# Altium schematic sheet Power.SchDoc
size A; SheetNumber: 5; SheetTotal: 5
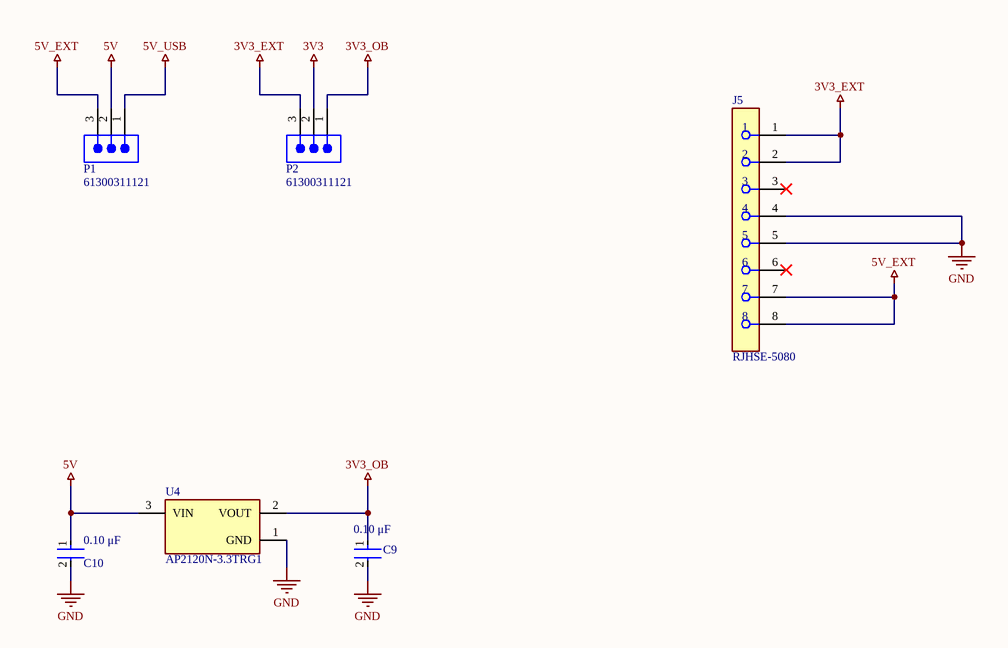
[diagram p0: Power.SchDoc]

## Parts
C9  Capacitance: 0.10 μF  [FP-C0603C-CF-MFG]  (hidden comment: C0603C104K5RACTU)
C10  Capacitance: 0.10 μF  [FP-C0603C-CF-MFG]  (hidden comment: C0603C104K5RACTU)
J5  RJHSE-5080  [FP-RJHSE-5080-MFG]
P1  61300311121  [61300311121]
P2  61300311121  [61300311121]
U4  AP2120N-3.3TRG1  [FP-SOT23-MFG]

## Nets
3V3: P2.2
3V3_EXT: J5.1 J5.2 P2.3
3V3_OB: C9.1 P2.1 U4.2(VOUT)
5V: C10.1 P1.2 U4.3(VIN)
5V_EXT: J5.7 J5.8 P1.3
5V_USB: P1.1
GND: C9.2 C10.2 J5.4 J5.5 U4.1(GND)

Not connected (* = marked no-connect by the designer): J5 3* 6*

## Library data of the parts
C9 C10 = CMP-2006-03061-2: CAP CER 0.1UF 50V X7R 0603; Manufacturer: KEMET; Tolerance: 0.1; Temperature Coefficient: 30ppm/°C; Material: Ceramic; Automotive Grade: Grade 1; Value: 0.10 μF; Multilayer: Yes; Tolerance  (fill in as +-): 10%; Temperature: -55°C to +125°C; RoHS: TRUE; Temperature Range High: +125°C; Lead Free: Yes; Octopart: https://octopart.com/c0603c104k5ractu-kemet-139244; Digikey Description: CAP CER 0.1UF 50V X7R 0603; Category: Cap; Package: C0603C-CF; ComponentLink2Description: Datasheet; Temperature Range Low: -55°C; Device Class L1: Passive Components; Voltage Rating: 50 V; Automotive: Yes; Device Class L3: Ceramic Capacitors; ComponentLink2URL: https://api.kemet.com/component-edge/download/datasheet/C0603C100J5GACAUTO.pdf; Device Class L2: Capacitors; Manufacturer Part Number: C0603C104K5RACTU; Temperature Characteristic: X7R; Height: 0.87mm; Supplier: Digikey; Supplier Part Number: 399-C0603C104K5RAC7867CT-ND; Stock: 4063890; Pricing: 1=0.11, 10=0.074, 50=0.0424, 100=0.0329, 500=0.02474, 1000=0.01944 (USD); Mounting Technology: Surface Mount; Pins: 2; Dielectric Material: Ceramic; Package Shape: Rectangular; Case/Package: 0603; Terminal Finish: Nickel; Min Operating Temperature: -55°C; Max Operating Temperature: 125°C; JESD-609 Code: e3; Capacitor Type: Ceramic; Package Style: SMTMeter; Packaging: Tape and Reel; Tolerance (fill in as +-): 10%; Rated DC Voltage (URdc): 50V; Temperature Characteristics Code: X7R; Termination: Wraparound; Length: 1.6mm; Width: 0.8mm; Reach SVHC Compliant: Yes; RoHS Compliant: Yes; ComponentLink1URL: https://datasheet.ciiva.com:443/pdfs/VipMasterIC/IC/KEME/KEME-S-A0008991654/KEME-S-A0008991654-1.pdf?src-supplier=IHS+Markit; ComponentLink1Description: https://datasheet.ciiva.com:443/pdfs/VipMasterIC/IC/KEME/KEME-S-A0008991654/KEME-S-A0008991654-1.pdf?src-supplier=IHS+Markit
J5 = CMP-02366-000003-1: CONN MOD JACK 8P8C R/A UNSHLD; Manufacturer: Amphenol; Current Rating: 1.5A; Voltage Rating: 125V; Pitch: 1.02mm; Conn Orientation: Right Angle; Number Of Contacts: 8; Is Female: yes; Conn Gender: Female; Connector Type: TELECOM AND DATACOM CONNECTOR; Contact Style: TELCOM, MODULAR; Number of Ports: 1; PCB Contact Pattern: STAGGERED; Option: General Purpose; Empty Shell: No; Body Breadth: 0.52inch; Body Depth: 0.59inch; Body Length: 0.62inch; Mounting Option 1: LOCKING; Plating Thickness: 50uin; Reference Standard: UL; Reliability: COMMERCIAL; Lead Free: Yes; Device Class L3: unset; Footprint Url: https://cdn.amphenol-icc.com/media/wysiwyg/files/drawing/rjhse5080.pdf?__cf_chl_jschl_tk__=e349db0bbbb6188a39347cd5e541b92fa02c9719-1587748343-0-AW7tChdeHzRPLX9gSWj7WrKaXQoY9BsmT9Ek0h-T62M9y3Rs9iypFcOtkzb-6sGYQEjFE-jcoNciDETCOZrh1rYyOesac5SvYLoLwHIsHvF4AKBlx-MXmfZUVk9OTTJLqyQq2qMm0PFRLJpNcK0nrKResqOniRSYixG2sPTmOPraH-ULJFBDL602CHqcI9KKBgTq90Jh1OL2Td4moJ99rFsJRJ1Tk_uoxGe8ublcP_ARu-uLpWcQrBcwOcHDTAwL29DAwVaqcH7ta8Ks7WMlHmVl_pILeEDwT0bE9vu5Pa5S3PtNRF1leuFkgi_FMbUxTDulc5xzbXSfng8srUIV1lWXny5nx1fZJEUa_w97yKjffzBMxiWLWVN-V7-uqAaPbyv_m-wRyw5O25OZNyJOeGU; ComponentLink2URL: https://cdn.amphenol-icc.com/media/wysiwyg/files/documentation/datasheet/inputoutput/io-modjack-rjhse.pdf; Device Class L1: Connectors; Package: CONN_MOD_JACK; Mouser Description: Modular Connectors / Ethernet Connectors R/A RJ45 NONSHIELDED 8 CONT NO LEDS; Manufacturer Part Number: RJHSE-5080; Octopart: https://octopart.com/rjhse-5080-amphenol-45060; Category: Conn; Height: 0.535inch; Temperature: -55°C to +85°C; Digikey Description: CONN MOD JACK 8P8C R/A UNSHLD; Device Class L2: Modular / Ethernet Connectors; Contact Material: Gold,Nickel; ComponentLink2Description: Datasheet; Temperature Range Low: -55°C; RoHS: TRUE; Automotive: No; Temperature Range High: +85°C; Supplier: Digikey; Supplier Part Number: RJHSE-5080-ND; Stock: 69947; Pricing: 1=1.03, 10=0.867, 36=0.83194, 72=0.81417, 108=0.7788, 252=0.70802, 504=0.6372, 1008=0.56641, 2520=0.51331 (USD); Mounting Technology: Panel,Board; Contact Finish - Mating: GOLD (50) OVER NICKEL (50); Contact Finish - Termination: Matte Tin (Sn); Insulation Color: Black; Insulation Material: Thermoplastic; Shell Material: Polyethylene; JESD-609 Code: e3; Body/Shell Style: JACK; Contact Gender: Female; Mounting Style: RIGHT ANGLE; Termination: Solder; Filter Feature: No; Mixed Contacts: No; Terminal Length: 0.1inch; Terminal Pitch: 2.032mm; Flammability Rating: UL94 V-0; Reach SVHC Compliant: Yes; RoHS Compliant: Yes; DIN Conformance: No; IEC Conformance: No; MIL Conformance: No; ComponentLink1URL: https://datasheet.ciiva.com:443/pdfs/VipMasterIC/IC/AMPH/AMPH-S-A0001396201/AMPH-S-A0001290431-1.pdf?src-supplier=IHS+Markit; ComponentLink1Description: https://datasheet.ciiva.com:443/pdfs/VipMasterIC/IC/AMPH/AMPH-S-A0001396201/AMPH-S-A0001290431-1.pdf?src-supplier=IHS+Markit; ComponentLink3URL: https://datasheet.ciiva.com/685/rjhse5080-685586.pdf?src-supplier=Digikey; ComponentLink3Description: https://datasheet.ciiva.com/685/rjhse5080-685586.pdf?src-supplier=Digikey; ComponentLink4URL: https://datasheet.ciiva.com/7629/1682821-7629402.pdf?src-supplier=Element14; ComponentLink4Description: https://datasheet.ciiva.com/7629/1682821-7629402.pdf?src-supplier=Element14; ComponentLink5URL: https://datasheet.ciiva.com/15171/getdatasheetpartid-643190-15171163.pdf?src-supplier=Verical; ComponentLink5Description: https://datasheet.ciiva.com/15171/getdatasheetpartid-643190-15171163.pdf?src-supplier=Verical; ComponentLink6URL: https://datasheet.ciiva.com/1432/1693748-1432448.pdf?src-supplier=Element14; ComponentLink6Description: https://datasheet.ciiva.com/1432/1693748-1432448.pdf?src-supplier=Element14
P1 P2 = CMP-1502-01062-2: NexarPartId: 32855521; Voltage Rating: 250V; Current Rating: 3A; Connector Type: Male Pin; Number of Positions: 3; Gender: Male; Contact Resistance: 20mΩ; Pitch: 2.54mm; Max Operating Temperature: 105°C; Lead Pitch: 2.54mm; Lead Free: Lead Free; Contact Mating Length: 5.9944mm; Contact Material: Copper; Number of Pins: 3; Orientation: Vertical; Height: 8.94mm; Packaging: Bulk; Min Operating Temperature: -40°C; Mount: Through Hole; RoHS: Compliant; Number of Contacts: 3; Operating Supply Voltage: 250V; Termination: Solder; Number of Rows: 1; Contact Plating: Gold; Color: Black; REACH SVHC: Unknown
U4 = CMP-12756-000008-1: IC REG LINEAR 3.3V 150MA SOT23; Manufacturer: Diodes Inc.; Min Supply Voltage: 2V; Standoff Height: 0.013mm; Max Junction Temp: +85°C; Output Type: Fixed; Max Supply Voltage: 6V; Accuracy Percentage: 2%; Nominal Supply Current: 25uA; Dropout Voltage: 300mV; Number Of Outputs: 1; Package Body Material: Plastic; Input Voltage Absolute-Max: 6.5V; Line Regulation-Max: 0.016%; Load Regulation-Max: 0.04%; Output Current1-Max: 100mA; Output Voltage1-Max: 3.366V; Output Voltage1-Min: 3.234V; Package Equivalence Code: TO-236; Regulator Type: FIXED POSITIVE SINGLE OUTPUT LDO REGULATOR; Time @ Peak Reflow Temperature-Max (s): 30s; Qualification Status: Not Qualified; Output Voltage: 3.3V; Footprint Url: https://www.diodes.com/assets/Package-Files/SOT23.pdf; Category: IC; Manufacturer Part Number: AP2120N-3.3TRG1; ComponentLink2Description: Datasheet; Device Class L1: Integrated Circuits (ICs); Octopart: https://octopart.com/ap2120n-3.3trg1-diodes+inc.-30954573; Temperature Range Low: -40°C; Temperature: -40°C to +85°C; Temperature Range High: +85°C; Package: SOT23; Digikey Description: IC REG LINEAR 3.3V 150MA SOT23; Height: 1.1mm; Mouser Description: AP2120 Series 3.3 V 0.15 A Surface Mount CMOS LDO Regulator - SOT23; RoHS: TRUE; ComponentLink2URL: https://www.diodes.com/assets/Package-Files/SOT23.pdf; Device Class L2: Power Management ICs; Device Class L3: Voltage Regulators - Linear; Output Current: 150mA; Ipc Land Pattern Name: SOT92P240X102-3; Lead Free: Yes; Automotive: No; Supplier: Digikey; Supplier Part Number: AP2120N-3.3TRG1DICT-ND; Stock: 948887; Pricing: 1=0.38, 10=0.281, 25=0.246, 100=0.1592, 250=0.1318, 500=0.10544, 1000=0.08084 (USD); Case/Package: TSSOP; Pins: 3; Package Shape: Rectangular; Terminal Finish: Tin; JESD-609 Code: e3; JESD-30 Code: R-PDSO-G3; Package Style: SMALL OUTLINE, THIN PROFILE, SHRINK PITCHMeter; Surface Mount: Yes; Technology: CMOS; Terminal Form: Gull Wing; Terminal Position: DUAL; Adjustability: FIXED; Dropout Voltage1-Max: 300mV; Dropout Voltage1-Nom: 300mV; Min Input Voltage: 2V; Moisture Sensitivity Level: 3; Channels: 1; Operating Temperature, TJ-Max: 85°C; Operating Temperature, TJ-Min: -40°C; Output Voltage1-Nom: 3.3V; Packaging: Tape and Reel; Peak Reflow Temperature (Cel): 260°C; Voltage Tolerance-Max: 2%; Length: 2.9mm; Width: 1.3mm; Height - Seated (Max): 1.2mm; Terminal Pitch: 0.95mm; Reach SVHC Compliant: Yes; RoHS Compliant: Yes; ComponentLink1URL: https://datasheet.ciiva.com:443/pdfs/VipMasterIC/IC/DIOD/DIOD-S-A0008513436/DIOD-S-A0008513436-1.pdf?src-supplier=IHS+Markit; ComponentLink1Description: https://datasheet.ciiva.com:443/pdfs/VipMasterIC/IC/DIOD/DIOD-S-A0008513436/DIOD-S-A0008513436-1.pdf?src-supplier=IHS+Markit; ComponentLink3URL: https://datasheet.ciiva.com/29569/ap2120-29569979.pdf?src-supplier=Digikey; ComponentLink3Description: https://datasheet.ciiva.com/29569/ap2120-29569979.pdf?src-supplier=Digikey; ComponentLink4URL: https://datasheet.ciiva.com/29569/ap2120-29569977.pdf?src-supplier=Digikey; ComponentLink4Description: https://datasheet.ciiva.com/29569/ap2120-29569977.pdf?src-supplier=Digikey; ComponentLink5URL: https://datasheet.ciiva.com/30016/ap2120-30016809.pdf?src-supplier=Avnet; ComponentLink5Description: https://datasheet.ciiva.com/30016/ap2120-30016809.pdf?src-supplier=Avnet; ComponentLink6URL: https://datasheet.ciiva.com/29569/ap2120-29569978.pdf?src-supplier=Digikey; ComponentLink6Description: https://datasheet.ciiva.com/29569/ap2120-29569978.pdf?src-supplier=Digikey